# EAGLE design robot (EAGLE 5.11)
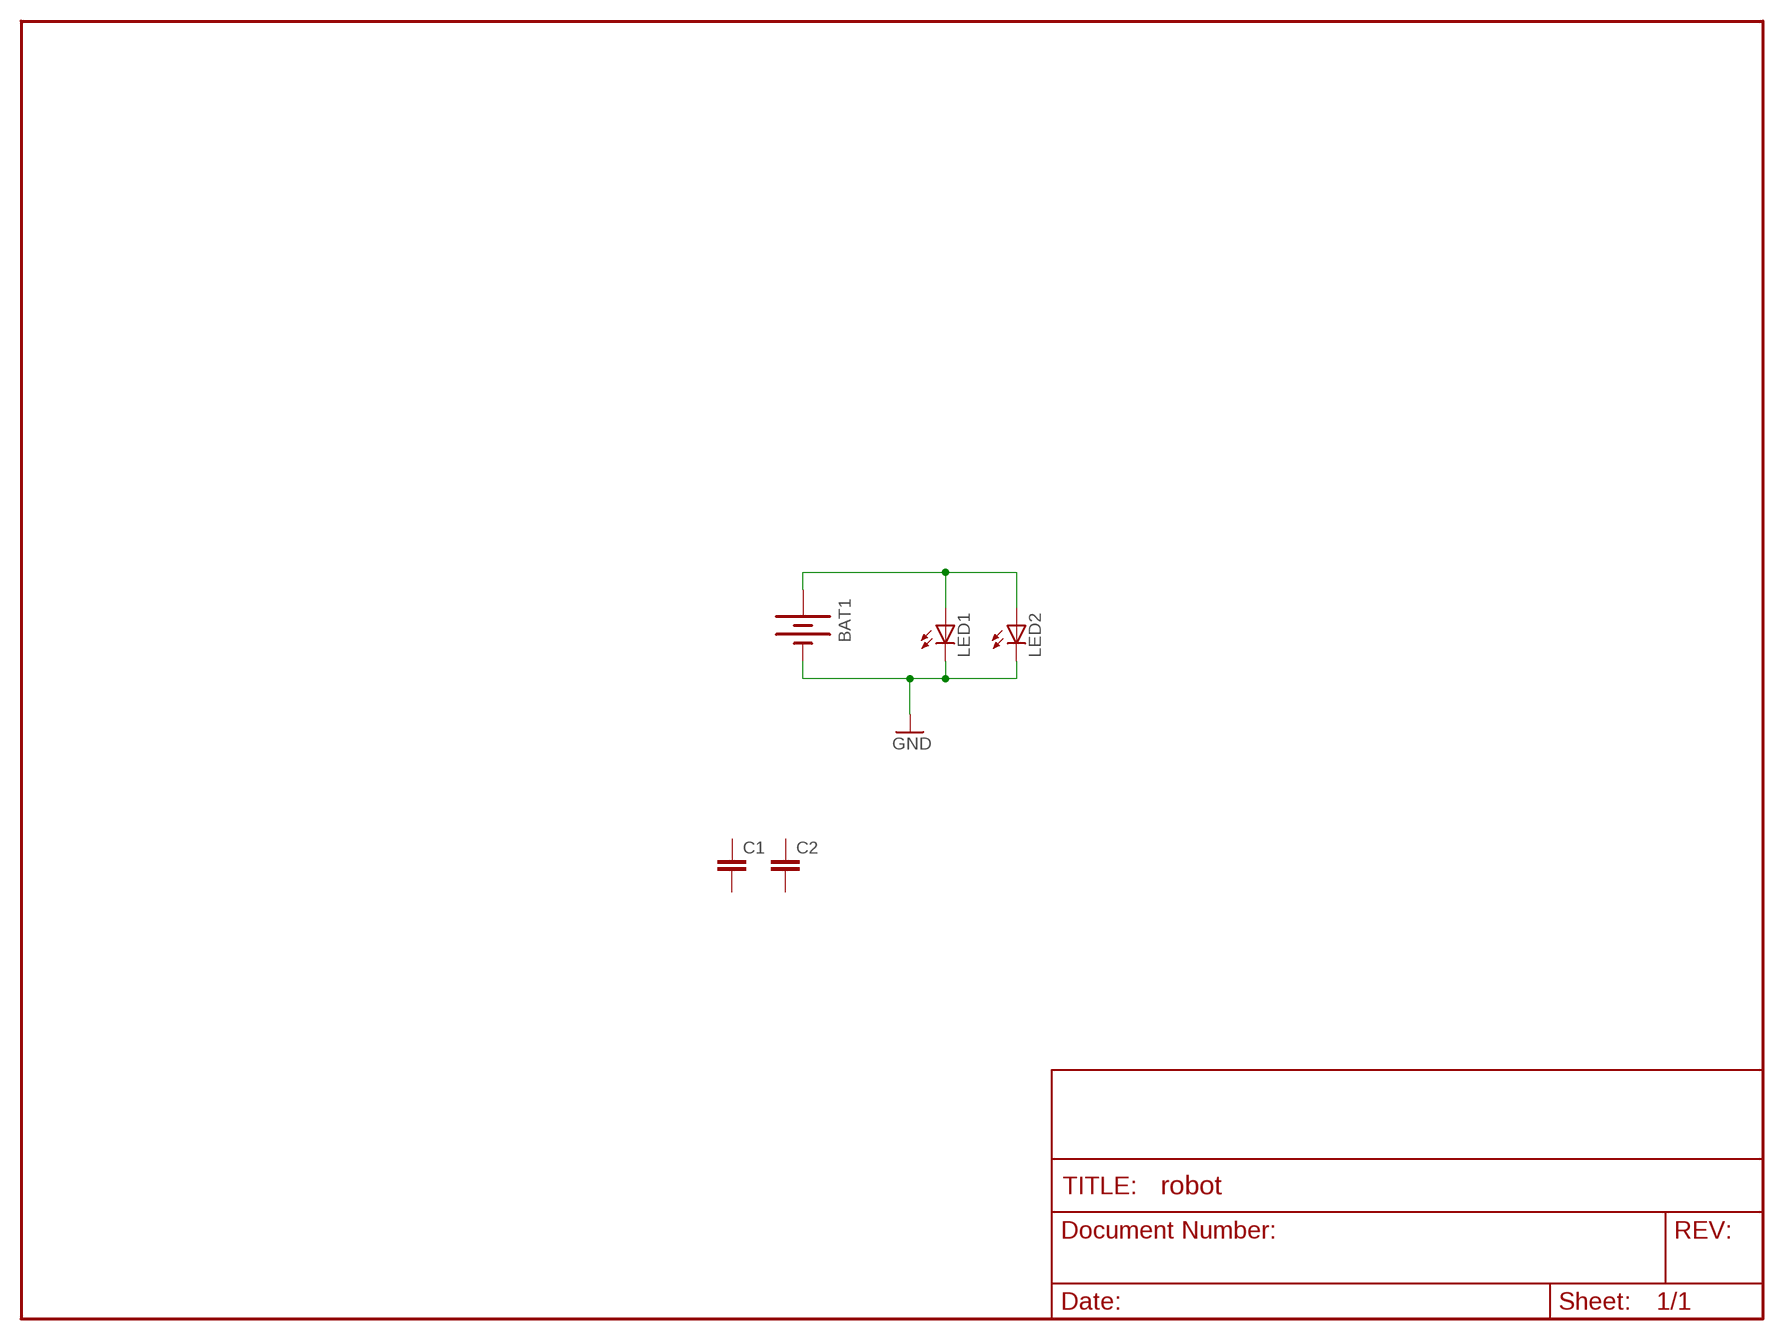
[diagram p0: schematic, sheet 1]

## Parts
BAT1  BATTERY20PTH  [BATTCOM_20MM_PTH]
C1  CAPPTH1  [CAP-PTH-5MM]
C2  CAPPTH1  [CAP-PTH-5MM]
LED1  LED5MM  [LED5MM]
LED2  LED5MM  [LED5MM]

## Nets
GND: BAT1.2(-) LED1.K(C) LED2.K(C)
N$1: BAT1.1(+) LED1.A LED2.A
Unconnected: C1.1 C1.2 C2.1 C2.2

## Library data of the parts
BAT1 = SparkFun:BATTERY: Battery Holders Various common sizes : AA, AAA, 20mm coin cell and 12mm coin cell.
C1 C2 = SparkFun:CAP: Capacitor Standard 0603 ceramic capacitor, and 0.1" leaded capacitor.
LED1 LED2 = SparkFun:LED: LEDs Standard schematic elements and footprints for 5mm, 3mm, 1206, and 0603 sized LEDs. 5mm - Spark Fun Electronics SKU : COM-00529 (and others)

## Board
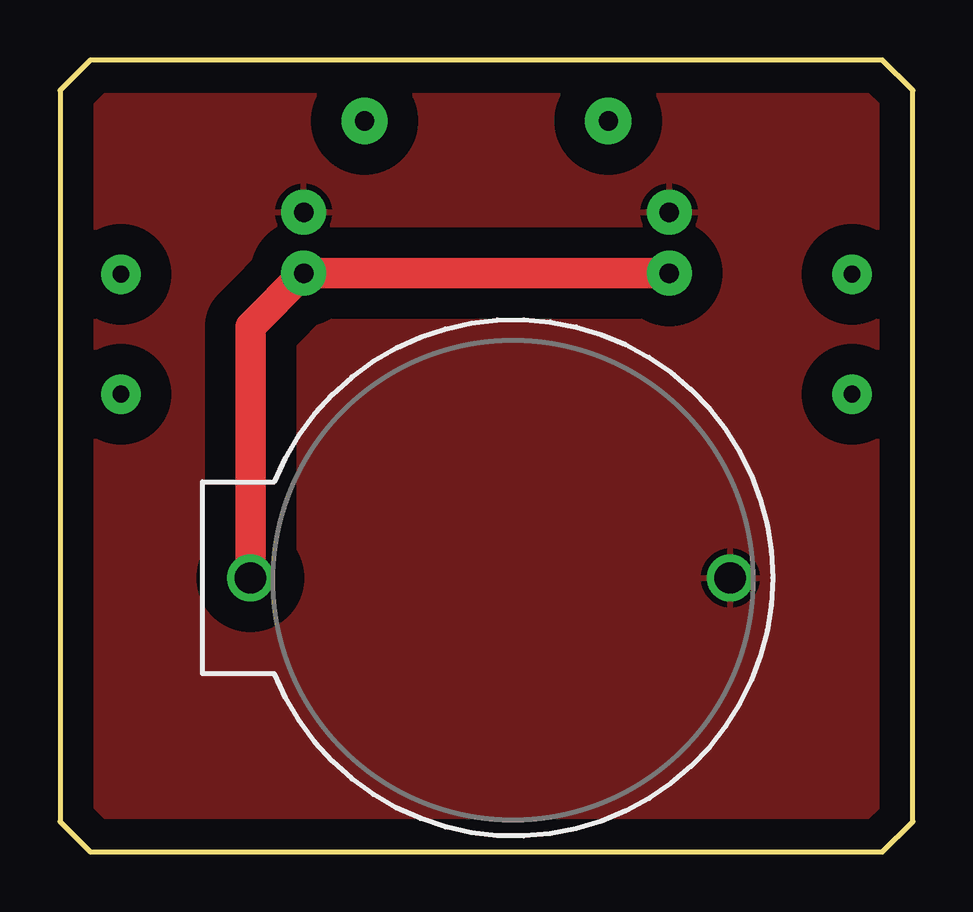
[diagram p1: board, top side]
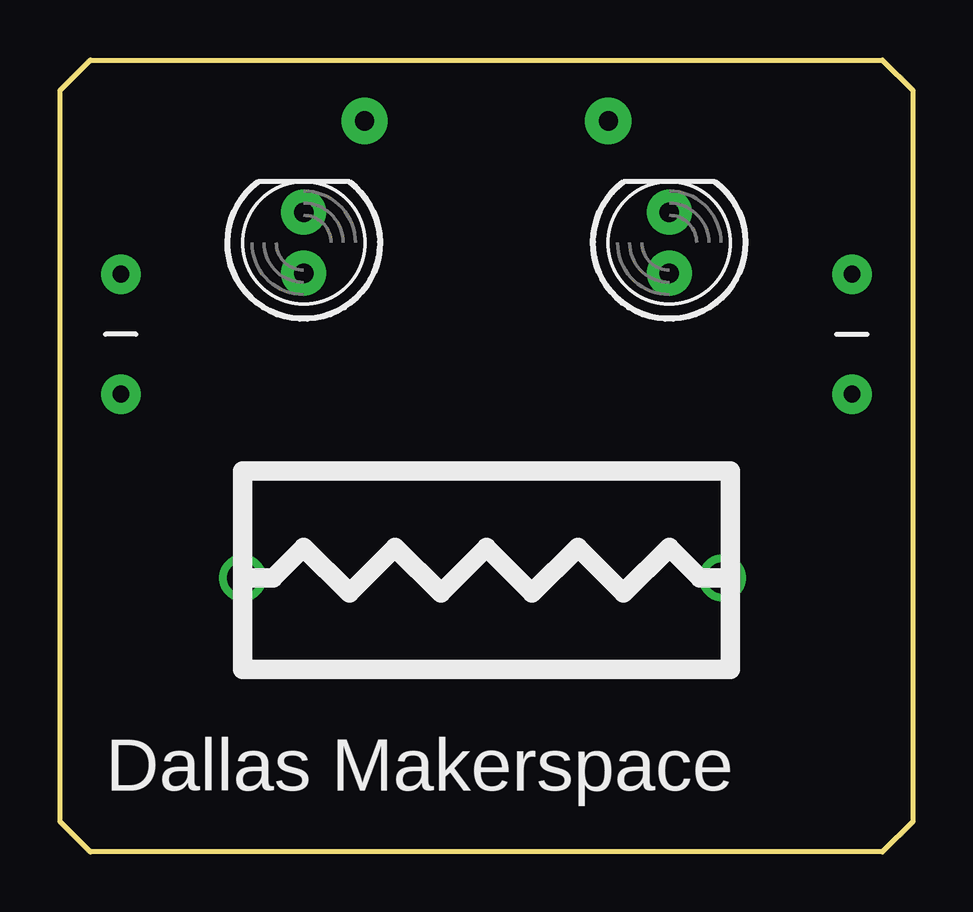
[diagram p2: board, bottom side, seen from below]

Size 35.56 x 33.02 mm. Coordinates in mm from the lower left corner, seen from the top.
Outline: 0,1.27 1.27,0 34.29,0 35.56,1.27 35.56,31.75 34.29,33.02 1.27,33.02 0,31.75 0,1.27
Copper layers (1*16): Top 0.035mm / dielectric 1.5mm / Bottom 0.035mm
Design rules "SparkFun": minimum track width 8mil, minimum drill 20mil, track to track 8mil, track to pad 8mil, pad to pad 8mil, via to via 8mil, smd to smd 8mil, copper to edge 10mil, drill to drill 8mil, minimum pad ring 12mil, minimum via ring 10mil, stop-mask expansion 4mil, vias tented up to drill 25mil, thermal gap 10mil

### Footprints (pad centres in the part's own frame; a part is rotated, then mirrored left to right if it is on the bottom)
BATTCOM_20MM_PTH = drill 1.3 round: 1 20,0; 2 0,0
CAP-PTH-5MM = drill 0.7 pad 1.651 round: 1 -2.5,0; 2 2.5,0
LED5MM = drill 0.813 pad 1.88 round: A -1.27,0; K 1.27,0

### Placement (x,y rotation side)
BAT1  27.94,11.43 180 top
C1  2.54,21.59 90 bottom
C2  33.02,21.59 270 bottom
LED1  25.4,25.4 90 bottom
LED2  10.16,25.4 90 bottom

### Tracks (layer width: path | path; a pad name or v marks a point on that pad's centre or on a via)
GND
  pour Top (isolate 1.27): -3.81,-3.81 39.37,-3.81 39.37,38.1 -3.81,38.1
N$1
  Top 1.27: BAT1.1 7.94,21.91 LED2.A LED1.A
N$2  (via drill 0.8 pad 1.93)
  other vias: 12.7,30.48
N$3  (via drill 0.8 pad 1.93)
  other vias: 22.86,30.48

### Text on the board
bPlace: Dallas Makerspace